# Altium schematic sheet 02.Index.SchDoc: CM3 IO
size 297 x 209 mm; Page Create Date: March  8, 1995; Page Number: 02; Page Size: A4; Comment: radxa_1010; Page Count: 20; RevCode: 1.36; Doc: Index; DsnPath: D:\WMS\黄工\[RC119]CM3_IO_V1.36\对外资料\radxa_cm3_io_board_v1360.DSN; SchematicName: CM3_IO V1.36; PageName: 02.Index; PageSize: A4; TopSchematic: True
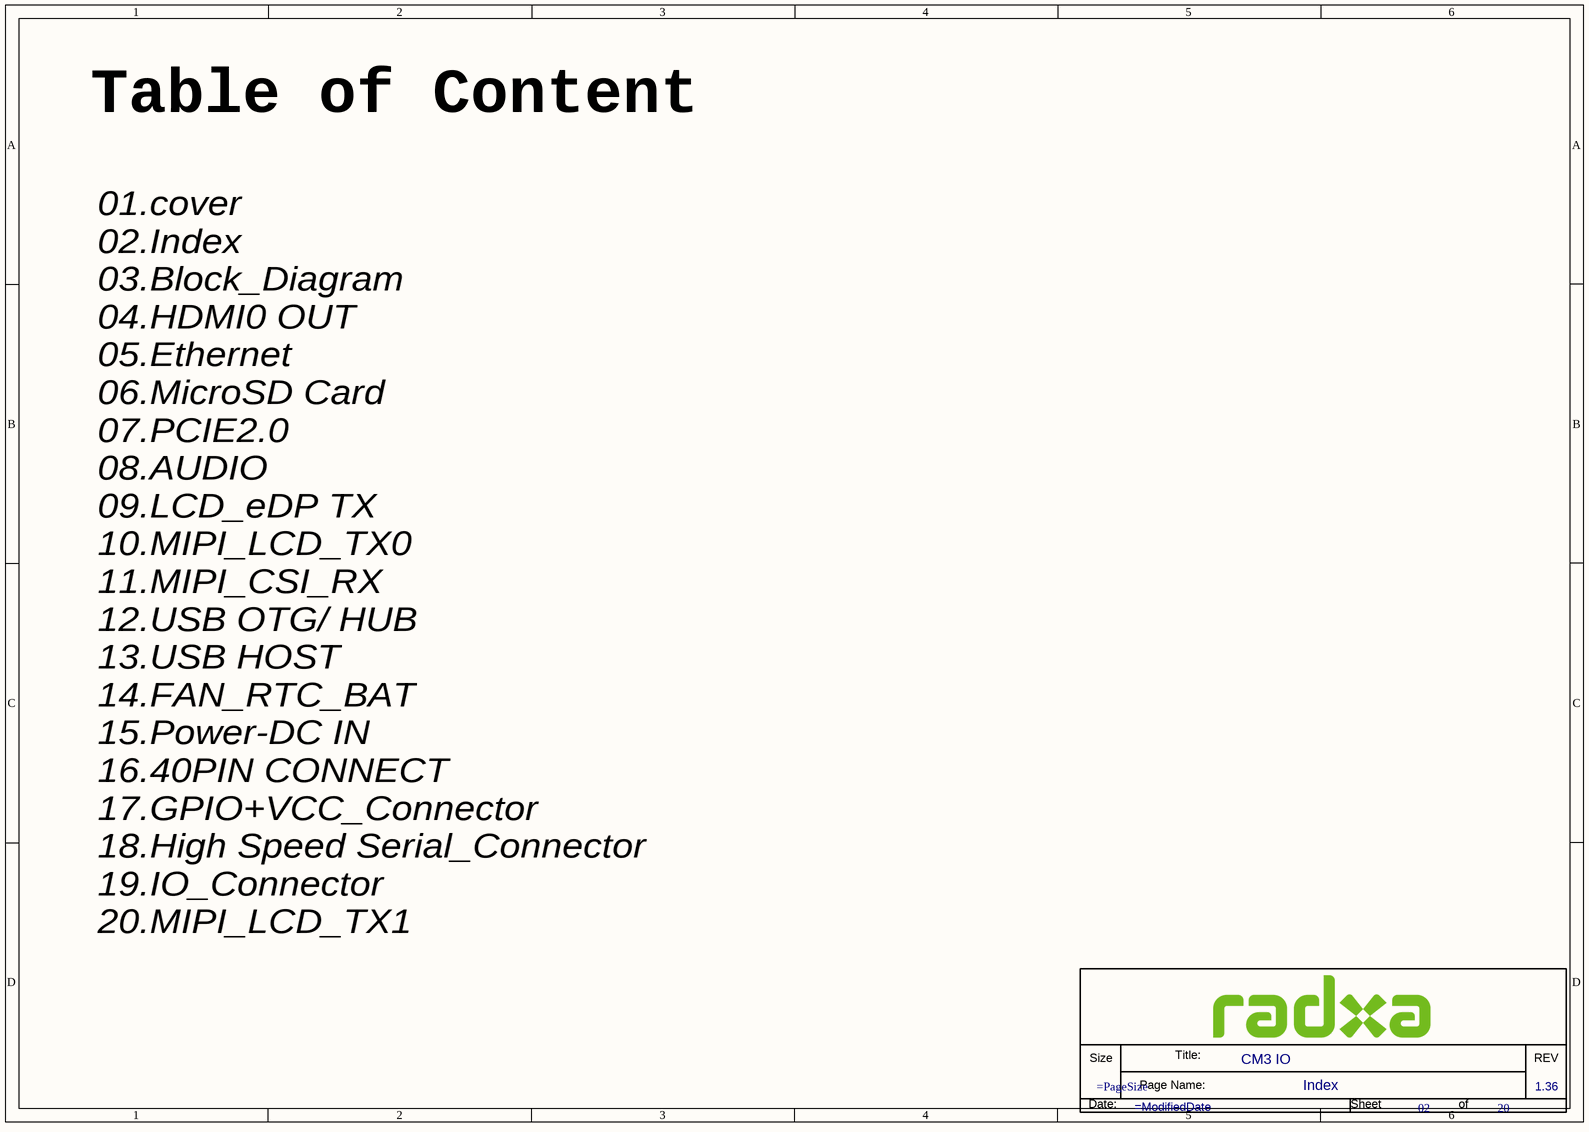
[diagram p0: 02.Index.SchDoc]

## Parts
*  Doc: Index  RevCode: 1.36  Title: CM3 IO  Page Number: 02  Page Count: 20  (hidden comment: radxa_1010)  (graphical)

## Notes on the sheet
- Table of Content
- 01.cover
  02.Index
  03.Block_Diagram
  04.HDMI0 OUT
  05.Ethernet
  06.MicroSD Card
  07.PCIE2.0
  08.AUDIO
  09.LCD_eDP TX
  10.MIPI_LCD_TX0
  11.MIPI_CSI_RX
  12.USB OTG/ HUB
  13.USB HOST
  14.FAN_RTC_BAT
  15.Power-DC IN
  16.40PIN CONNECT
  17.GPIO+VCC_Connector
  18.High Speed Serial_Connector
  19.IO_Connector
  20.MIPI_LCD_TX1
- (in symbol radxa_1010) Title:; Size; REV; Page Name:; Date:; Sheet; of

## Library data of the parts
* = radxa_1010: Page Create Date: March  8, 1995; Page Size: =PageSize; Page Modify Date: =ModifiedDate